# Altium schematic sheet Placa2.SchDoc
size A4; SheetNumber: 1; SheetTotal: 1
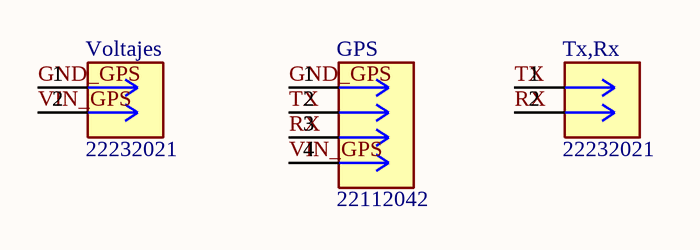
[diagram p0: Placa2.SchDoc]

## Parts
GPS  22112042  [CONN_A-6373-04A_MOL]
Tx,Rx  22232021  [CONN_A-6373-02A_MOL]
Voltajes  22232021  [CONN_A-6373-02A_MOL]

## Nets
GND_GPS: GPS.1 Voltajes.1
RX: GPS.3 Tx,Rx.2
TX: GPS.2 Tx,Rx.1
VIN_GPS: GPS.4 Voltajes.2

## Library data of the parts
Tx,Rx Voltajes = 22232021: Connector Header Through Hole 2 position 0.100 (2.54mm); MF: Molex; SnapEDA_Link: https://www.snapeda.com/parts/22232021/Molex/view-part/?ref=snap; Package: None; Value: *; MP: 22232021; Check_prices: https://www.snapeda.com/parts/22232021/Molex/view-part/?ref=eda
GPS = 22112042: Package: None; Price: None; Value: *; MP: 22112042; Availability: Unavailable